# Altium schematic sheet USB-HUB.SchDoc
size A4
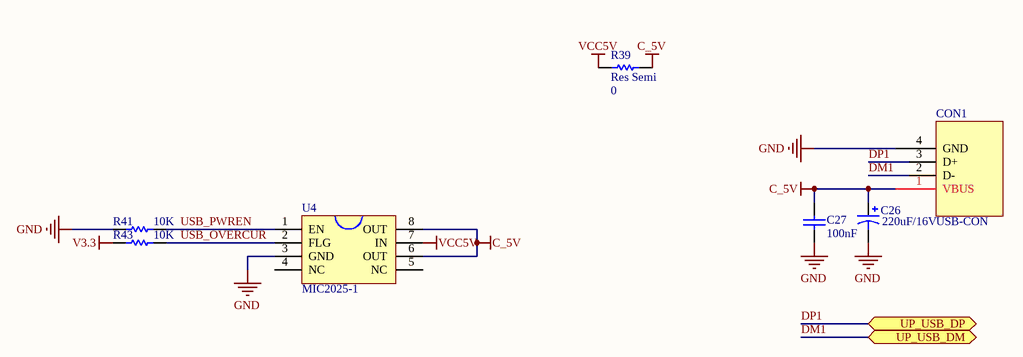
[diagram p0: USB-HUB.SchDoc]

## Parts
C26  220uF/16V  [16V220U-tie]
C27  100nF  [R0603N]
CON1  USB-CON  [1364372]
R39  Res Semi  value 0  [6-0805_N]
R41  10K  [R0603N]
R43  10K  [R0603N]
U4  MIC2025-1  [SO8_N]

## Ports
UP_USB_DM, UP_USB_DP

## Nets
C_5V: C26.1 C27.2 CON1.1(VBUS) R39.2 U4.6(OUT) U4.8(OUT)
GND: C26.2 C27.1 CON1.4(GND) R41.2 U4.3(GND)
V3.3: R43.2
VCC5V: R39.1 U4.7(IN)
DM1: CON1.2(D-) ; port UP_USB_DM
DP1: CON1.3(D+) ; port UP_USB_DP
USB_OVERCUR: R43.1 U4.2(FLG)
USB_PWREN: R41.1 U4.1(EN)

Not connected (* = marked no-connect by the designer): U4 4(NC) 5(NC)

## Library data of the parts
C26 = Cap Pol1: Polarized Capacitor (Radial); Published: 8-Jun-2000; LatestRevisionDate: 17-Jul-2002; LatestRevisionNote: Re-released for DXP Platform.; PackageReference: RB7.6-15; Publisher: Altium Limited; PackageDescription: Polarized Capacitor (Radial); 2 Leads; Value: 220uF/16V
C27 = CAP: Value: 100nF
R39 = Res Semi: Semiconductor Resistor; Published: 8-Jun-2000; LatestRevisionDate: 17-Jul-2002; LatestRevisionNote: Re-released for DXP Platform.; PackageReference: AXIAL-0.5; Publisher: Altium Limited
R41 R43 = RES: Value: 10K